# EasyEDA Pro project ProPrj_幻灯机控制板_2025-12-10.epro

# Schematic Schematic1
Board Name: 幻灯机; Create Date: 2025-10-30; Page Name: P1; Project Name: 幻灯机控制板; Schematic Name: Schematic1; Update Date: 2025-11-19; Company: 光水; Drawed: 光水; Page Size: A3; Reviewed: 光水; Version: V1.0
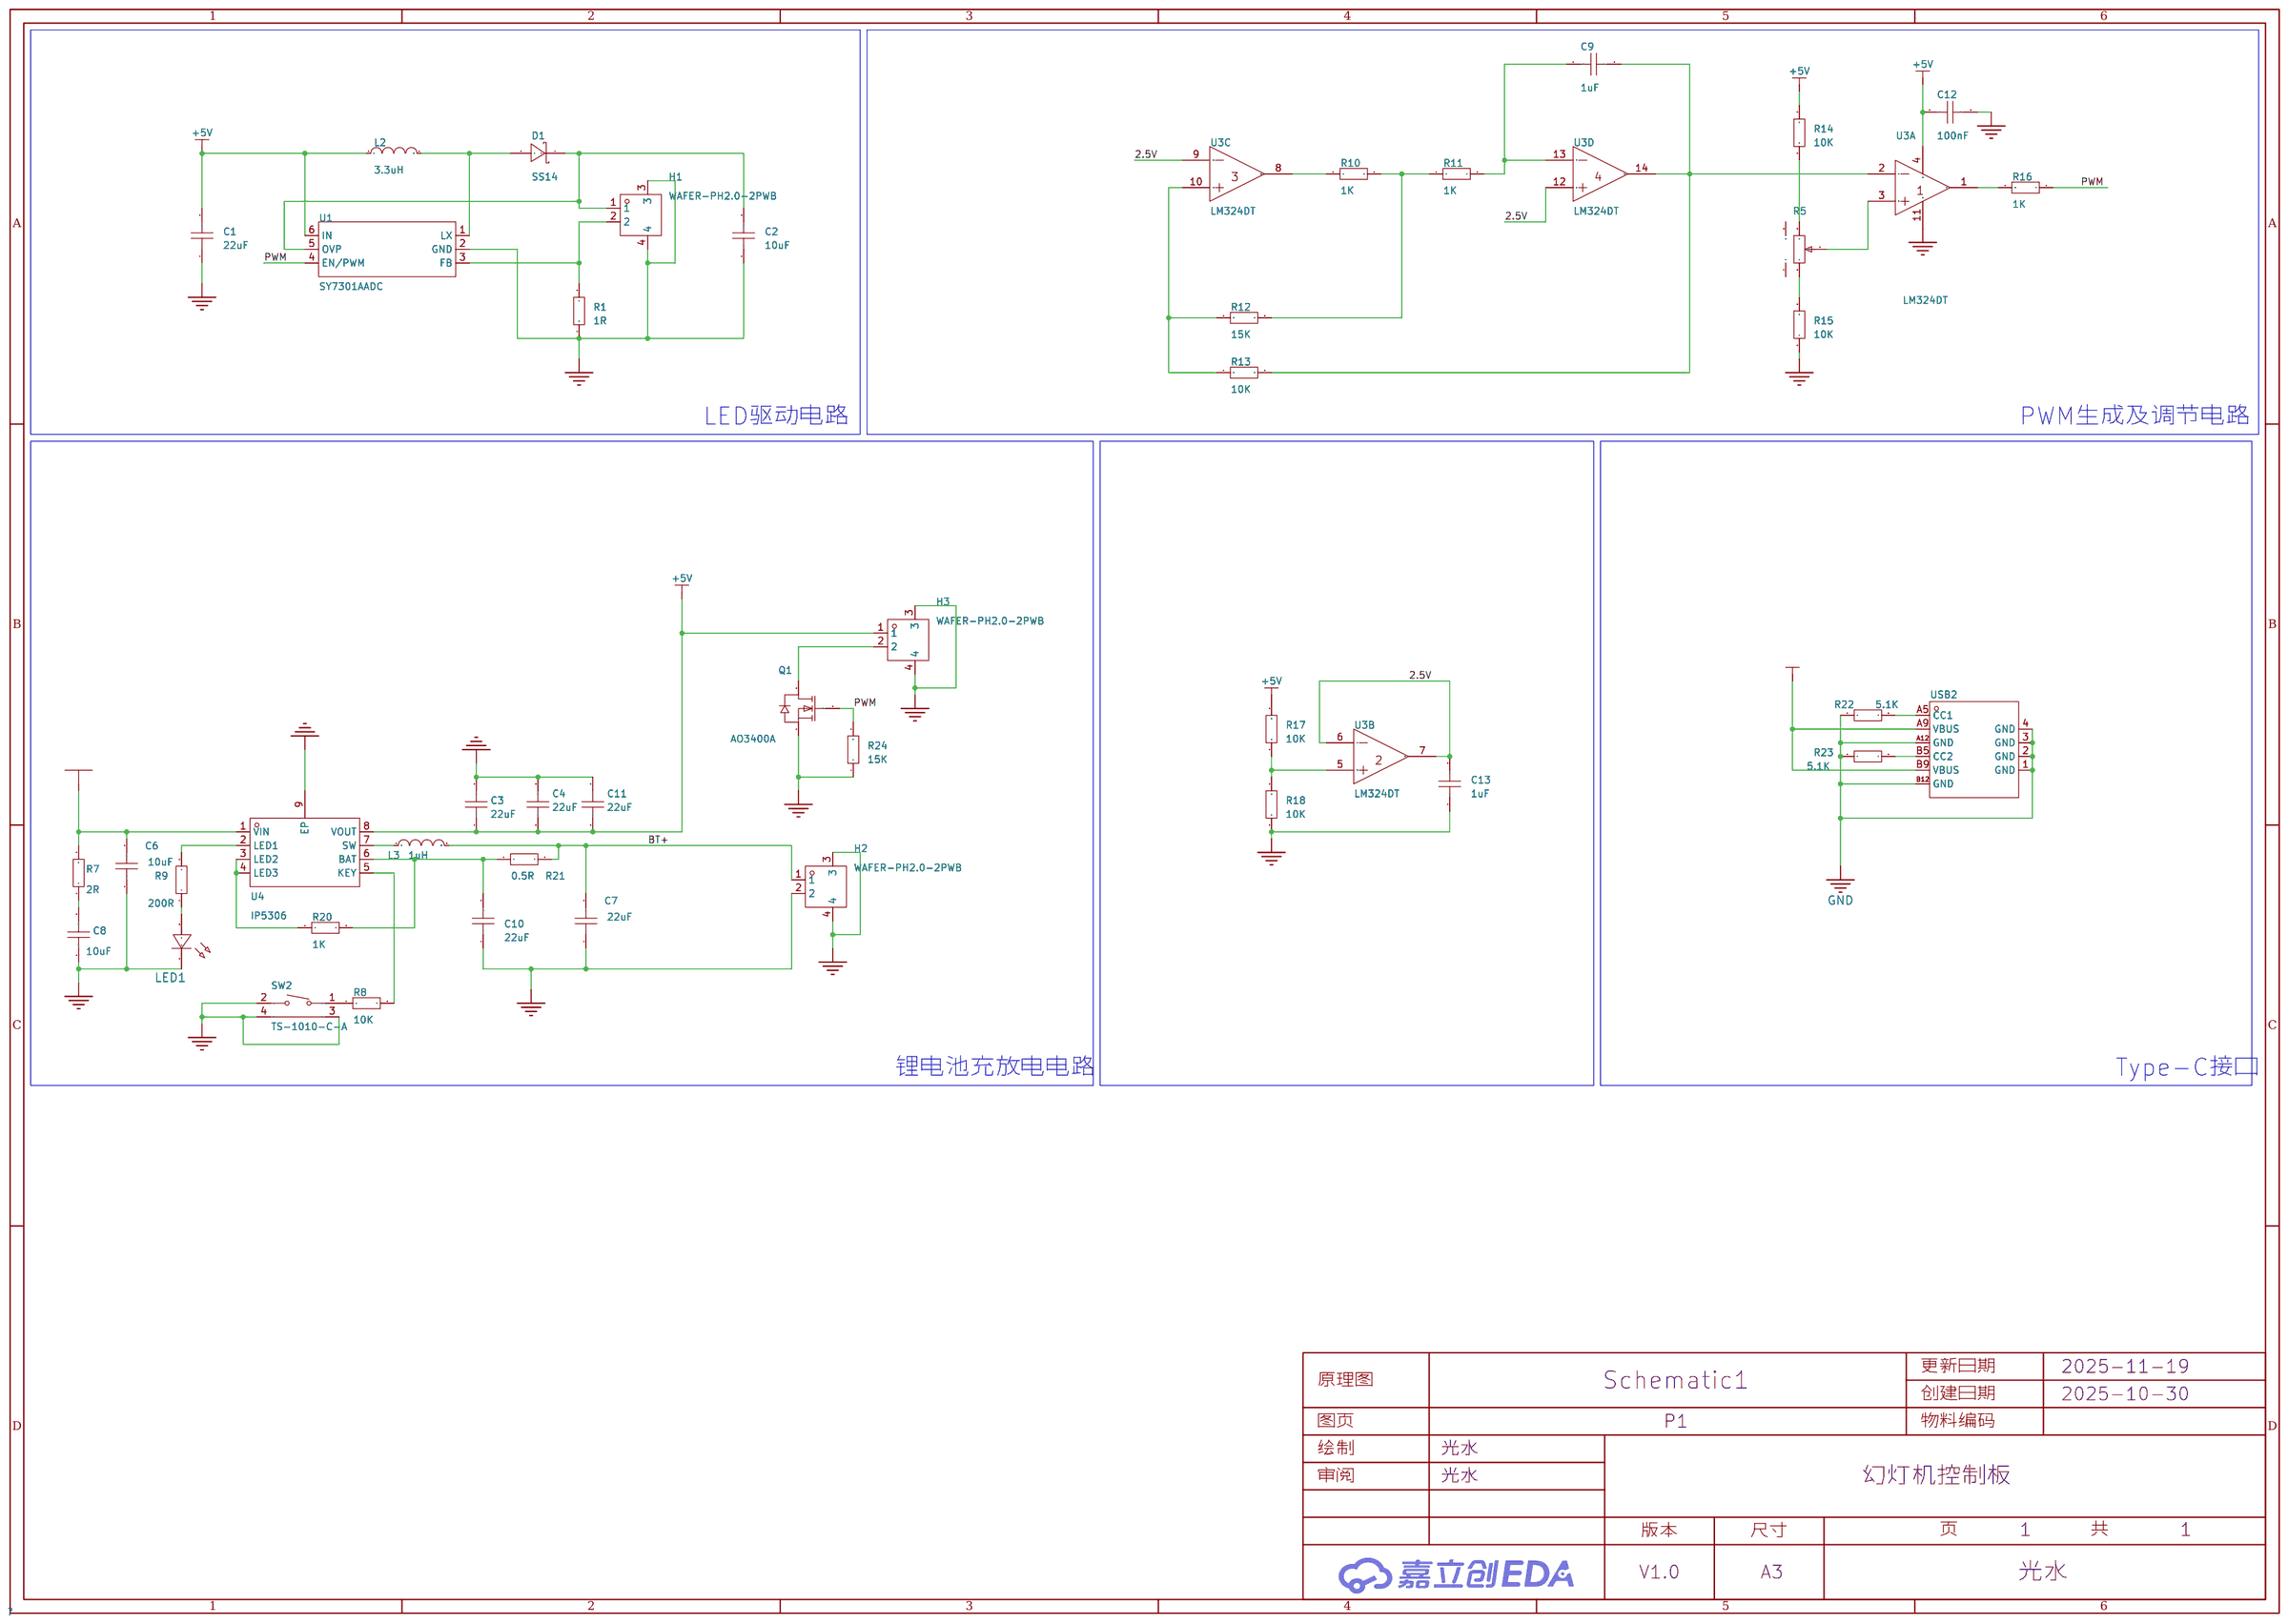
[diagram p0: schematic sheet]

## Parts
C1  22uF  [C0805]
C2  10uF  [C1206]
C3  22uF  [C0805]
C4  22uF  [C0805]
C6  10uF  [C0805]
C7  22uF  [C0805]
C8  10uF  [C0805]
C9  1uF  [C0603]
C10  22uF  [C0805]
C11  22uF  [C0805]
C12  100nF  [C0603]
C13  1uF  [C0603]
D1  SS14  [SMA_L4.2-W2.6-LS5.0-RD_1]
H1  WAFER-PH2.0-2PWB  [CONN-SMD_2P-P2.00_XUNPU_WAFER-PH2.0-2PWB]
H2  WAFER-PH2.0-2PWB  [CONN-SMD_2P-P2.00_XUNPU_WAFER-PH2.0-2PWB]
H3  WAFER-PH2.0-2PWB  [CONN-SMD_2P-P2.00_XUNPU_WAFER-PH2.0-2PWB]
L2  3.3uH  [IND-SMD_L7.3-W6.6]
L3  1uH  [IND-SMD_L6.8-W6.8_SMMS0630]
LED1  -  [LED0603-RD_BLUE]
Q1  AO3400A  [SOT-23-3_L2.9-W1.3-P1.90-LS2.4-BR]
R1  1R  [R1210]
R5  RV09AF-40-15K-B10K  [RES-ADJ-TH_RV09]
R7  2R  [R0603]
R8  10K  [R0603]
R9  200R  [R0603]
R10  1K  [R0603]
R11  1K  [R0603]
R12  15K  [R0603]
R13  10K  [R0603]
R14  10K  [R0603]
R15  10K  [R0603]
R16  1K  [R0603]
R17  10K  [R0603]
R18  10K  [R0603]
R20  1K  [R0603]
R21  0.5R  [R0603]
R22  5.1K  [R0603]
R23  5.1K  [R0603]
R24  15K  [R0603]
SW2  TS-1010-C-A  [KEY-SMD_TX-1010-X-X]
U1  SY7301AADC  [TSOT-23-6_L2.9-W1.6-P0.95-LS2.8-BR]
U3  LM324DT  [SOIC-14_L8.7-W3.9-P1.27-LS6.0-BL]  (sections 1,2,3,4)
U4  IP5306  [ESOP-8_L4.9-W3.9-P1.27-LS6.0-BL-EP]
USB2  -  [usb-c-smd_typec-250d-bcp6]

## Library data of the parts
C1 C10 = CAP_0805: Supplier Footprint: 0805
C2 = CAP_1206: Supplier Footprint: 1206
C3 C4 C6-C8 C11 = CAP_0805: 容值:100nF;精度:±10%;额定电压:50V;温度系数:X7R;; Supplier Footprint: 0805
C9 C12 C13 = CAP_0603: Supplier Footprint: 0603
D1 = SS14_C2480: 二极管配置:独立式;正向压降(Vf):550mV@1A;直流反向耐压(Vr):40V;整流电流:1A;; LCSC Part Name: 电压:40V 电流:1A; Supplier Part: C2480; Manufacturer: MDD(辰达半导体); Supplier Footprint: SMA(DO-214AC); JLCPCB Part Class: 基础库; Datasheet: https://item.szlcsc.com/datasheet/SS14/2857.html; Supplier: LCSC; Diode Configuration: 独立式; Voltage - Forward(Vf@If): 550mV@1A; Voltage - DC Reverse(Vr): 40V; Current - Rectified: 1A; Reverse Leakage Current (Ir): 300uA@40V; Operating Junction Temperature Range: -55℃~+150℃; Non-Repetitive Peak Forward Surge Current: 25A
H1-H3 = WAFER-PH2.0-2PWB: 插针结构:1x2P;间距:2mm;安装方式:卧贴;参考系列:PH;总PIN数:2P;排数:1;每排PIN数:2;行距:-;额定电流:2A;触头材质:黄铜;触头镀层:锡;工作温度:-25℃~+85℃;; LCSC Part Name: 1x2P 间距:2mm 卧贴 系列:PH; Supplier Part: C3029440; Manufacturer: XUNPU(讯普); Supplier Footprint: SMD,P=2mm,卧贴; JLCPCB Part Class: 扩展库; Datasheet: https://item.szlcsc.com/datasheet/WAFER-PH2.0-2PWB/3561452.html; Supplier: LCSC; Pins Structure: 1x2P; Pitch: 2mm; Mounting Type: 卧贴; Reference Series: PH; Number of Pins: 2P; Number of Rows: 1; Number of PINs Per Row: 2; Current Rating: 2A; Contact Material: 黄铜; Contact Plating: 锡; Operating Temperature: -25℃~+85℃; Voltage Rating: 250V; Plastic Material: LCP; Supplementary Features: 辅助焊脚; Color: 米色; Z-Height of the Board: 5.6mm; X-Length of Bottom Edge on Board (Spacing Line): 8mm; Y-Width of Bottom Edge on Board: 7.59mm
L2 = SMMS0630-3R3M: 电感值:3.3uH;精度:±20%;额定电流:-;饱和电流(Isat):9.5A;类型:-;; LCSC Part Name: 3.3uH ±20% 9.5A; Supplier Part: C128687; Manufacturer: SXN(顺翔诺); Supplier Footprint: SMD,7.3x6.6mm; JLCPCB Part Class: 扩展库; Datasheet: https://item.szlcsc.com/datasheet/SMMS0630-3R3M/139972.html; Supplier: LCSC; Tolerance: ±20%; Current - Saturation(Isat): 9.5A; DC Resistance(DCR): 35mΩ
L3 = SMMS0630-1R0M: 电感值:1uH;精度:±20%;额定电流:-;饱和电流(Isat):16A;类型:-;; LCSC Part Name: 1uH ±20% 16A; Supplier Part: C128684; Manufacturer: SXN(顺翔诺); Supplier Footprint: SMD,7.3x6.6mm; JLCPCB Part Class: 扩展库; Datasheet: https://item.szlcsc.com/datasheet/SMMS0630-1R0M/139969.html; Supplier: LCSC; Tolerance: ±20%; Current - Saturation(Isat): 16A; DC Resistance(DCR): 7.25mΩ
LED1 = LED_0603-R: 发光颜色:红灯;二极管配置:-;透镜颜色:无色透明;主波长:617.5nm;峰值波长:632nm;色温:-;光通量(25时):-;测试电流:5mA;正向电压(VF):2.2V;发光强度:28.5mcd;功率:60mW;发光角度:120°;安装方式:-;工作温度:-40~+85;; Supplier Footprint: 0603; Supplier Part: C72044
Q1 = AO3400A_C20917: 数量:-;漏源电压(Vdss):30V;连续漏极电流(Id):-;导通电阻(RDS(on)):48mΩ@2.5V;耗散功率(Pd):-;阈值电压(Vgs(th)):1.45V@250uA;; LCSC Part Name: 1个N沟道 耐压:30V 电流:5.7A; Supplier Part: C20917; Manufacturer: AOS; Supplier Footprint: SOT-23-3L; JLCPCB Part Class: 基础库; Datasheet: https://item.szlcsc.com/datasheet/AO3400A/21629.html; Supplier: LCSC; Drain to Source Voltage: 30V; RDS(on): 48mΩ@2.5V; Gate Threshold Voltage (Vgs(th)): 1.45V@250uA; Gate Charge(Qg): 7nC@10V; Input Capacitance(Ciss): 630pF@15V; Operating Temperature: -55℃~+150℃@(Tj); Type: N沟道
R1 = Res_1210: Supplier Footprint: 1210
R5 = RV09AF-40-15K-B10K: Supplier Part: C5151445; Supplier Footprint: 插件; JLCPCB Part Class: Extended Part; Datasheet: https://atta.szlcsc.comnull; Supplier: LCSC
R7-R18 R20-R24 = Res_0603: Supplier Footprint: 0603
SW2 = TS-1010-C-A: 触点电流:50mA;额定电压(DC):12V;绝缘电阻:100mΩ;电路结构:单刀单掷;安装方式:卧贴;按钮形状:矩形按钮;按钮/盖帽颜色:黑色;带灯:无;作用力:260gf;机械寿命:100000;工作温度:-30℃~+85℃;开关长度:2mm;开关宽度:4mm;开关高度:3.5mm;带支架:否;; LCSC Part Name: 2x4x3.5小侧按260gf带固定柱; Supplier Part: C692458; Manufacturer: XKB Connectivity(中国星坤); Supplier Footprint: SMD; JLCPCB Part Class: 扩展库; Datasheet: https://atta.szlcsc.com/upload/public/pdf/source/20211011/09621D275CE0F472C941775DFBBCCC96.pdf; Supplier: LCSC; Contact Current: 50mA; Voltage Rating (DC): 12V; Insulation Resistance: 100mΩ; Circuit: 单刀单掷; Mounting Style: 卧贴; Actuator Style: 矩形按钮; Actuator/Cap Color: 黑色; With Lamp: 无; Operating Force: 260gf; Mechanical Life: 100000; Operating Temperature: -30℃~+85℃; Switch Length: 2mm; Switch Width: 4mm; Switch Height: 3.5mm; Strike Gundam: 否
U1 = SY7301AADC: 开关频率:800kHz~1.2MHz;通道数:1;调光:PWM；模拟;拓扑结构:升压;; Supplier Part: C160791; Manufacturer: Silergy(矽力杰); Supplier Footprint: TSOT-23-6; JLCPCB Part Class: 扩展库; Datasheet: https://item.szlcsc.com/datasheet/SY7301AADC/172172.html; Supplier: LCSC; Frequency - Switching: 800kHz~1.2MHz; Number of Channels: 1; Dimming: PWM；模拟; Topology: 升压; Operating temperature: -40℃~+125℃
U3 = LM324DT: 放大器数:四路;轨到轨:-;增益带宽积(GBP):1.3MHz;输入失调电压(Vos):5mV;压摆率(SR):20V/us;输入偏置电流(Ib):300nA;; LCSC Part Name: 低功耗四路运算放大器; Supplier Part: C71035; Manufacturer: ST(意法半导体); Supplier Footprint: SOIC-14; Datasheet: https://item.szlcsc.com/datasheet/LM324DT/72134.html; Supplier: LCSC; Number of Channels: 四路; Maximum Power Supply Range (Vdd-Vss): 30V; Gain Bandwidth Product: 1.3MHz; Vos - Input Offset Voltage: 5mV; Input Offset Voltage Drift(Vos TC): 30uV/℃; Slew Rate: 20V/us; Ib - Input Bias Current: 300nA; Input Offset Current(Ios): 20nA; Noise density(eN): 40nV/√Hz@1kHz; Common Mode Rejection Ratio(CMRR): 80dB; Input offset current drift(Ios TC): 200pA/℃; Quiescent Current: 1.2mA; Output Current: 70mA; Operating Temperature: 0℃~+70℃; Single supply: 3V~30V; Dual Supply: -15V~-1.5V；1.5V~15V
U4 = IP5306: 工作电压:4.65V~5.5V;最大充电电流:2.1A;电池类型:锂电池;电池节数:1;; LCSC Part Name: 集成2.1A充电器和2.1A放电器的全集成移动电源系统级芯片; Supplier Part: C181692; Manufacturer: INJOINIC(英集芯); Supplier Footprint: ESOP-8; Datasheet: https://item.szlcsc.com/datasheet/IP5306/193089.html; Supplier: LCSC; The Chip Type: 充电芯片；保护芯片; Voltage - Supply: 4.65V~5.5V; Charge Current - Max: 2.1A; Charging Saturation Voltage: 4.2V; End-Off Voltage: 3V; Type of Battery: 锂电池; Number of Cells: 1; Operating Temperature: 0℃~+70℃; Supply Current (Iq): 100uA; Interface: I2C
USB2 = typec-250d-bcp6: 连接器类型:Type-C;标准:USB 3.1;公母:母座;触点数量:6;端口数量:1;安装方式:卧贴;额定电流 - 电源:3A;工作温度范围:-25~+85;焊接温度(最大值):260;; LCSC Part Name: Type-C 母座 卧贴; Supplier Part: C720626; Manufacturer: XUNPU(讯普); Manufacturer Part: TYPEC-250D-BCP6; Supplier Footprint: SMD,8.94x6.8x3.16mm; JLCPCB Part Class: Extended Part; Datasheet: https://atta.szlcsc.com/upload/public/pdf/source/20200812/C720626_0B3D9525FB9C6D818696E28704B18234.pdf; Supplier: LCSC; Connector Type: Type-C; Standard: USB 3.1; Gender: 母座; Number of Contacts: 6; Number of Ports: 1; Mounting Style: 卧贴; Current Rating - Power (Max): 3A; Operating Temperature Range: -25~+85; Welding Temperature (Max): 260

## Nets
2.5V: C13.2 U3.6(IN2-) U3.7(OUT2) U3.9(IN3-) U3.12(IN4+)
+5V: C1.2 C3.1 C4.1 C11.1 C12.1 H3.1 L2.1 R14.2 R17.2 U1.6(IN) U3.4(VCC+) U4.8(VOUT)
GND: C1.1 C2.1 C3.2 C4.2 C6.1 C7.1 C8.1 C10.1 C11.2 C12.2 C13.1 H1.3 H1.4 H2.2 H2.3 H2.4 H3.3 H3.4 LED1.1(C) Q1.2(S) R1.1 R15.1 R18.1 R22.1 R23.2 R24.1 SW2.2 SW2.3 SW2.4 U1.2(GND) U3.11(VCC-) U4.9(EP) USB2.1(GND) USB2.2(GND) USB2.3(GND) USB2.4(GND) USB2.A12(GND) USB2.B12(GND)
BT+: C7.2 H2.1 L3.2 R21.2
PWM: Q1.1(G) R16.2 R24.2 U1.4(EN/PWM)
VUSB: C6.2 R7.2 U4.1(VIN) USB2.A9(VBUS) USB2.B9(VBUS)
$1N518: D1.2(A) L2.2 U1.1(LX)
$1N603: C2.2 D1.1(K) H1.1 U1.5(OVP)
$1N607: H1.2 R1.2 U1.3(FB)
$1N1217: L3.1 U4.7(SW)
$1N1218: C8.2 R7.1
$1N1224: R9.2 U4.2(LED1)
$1N1228: R8.1 SW2.1
$1N1229: R8.2 U4.5(KEY)
$1N1231: LED1.2(A) R9.1
$1N1695: R10.1 U3.8(OUT3)
$1N1699: R10.2 R11.1 R12.2
$1N1705: C9.1 R11.2 U3.13(IN4-)
$1N1798: R12.1 R13.1 U3.10(IN3+)
$1N1817: C9.2 R13.2 U3.2(IN1-) U3.14(OUT4)
$1N3380: R5.2 U3.3(IN1+)
$1N3457: R16.1 U3.1(OUT1)
$1N3593: R17.1 R18.2 U3.5(IN2+)
$1N3974: R20.1 U4.3(LED2) U4.4(LED3)
$1N4073: C10.2 R20.2 R21.1 U4.6(BAT)
$1N5788: H3.2 Q1.3(D)
$1N5796: R5.3 R14.1
$1N5800: R5.1 R15.2
$1N5934: R22.2 USB2.A5(CC1)
$1N5935: R23.1 USB2.B5(CC2)

Not connected (* = marked no-connect by the designer): R5 4 5

## Notes on the sheet
- LED驱动电路
- PWM生成及调节电路
- 锂电池充放电电路
- Type-C接口

# Board PCB1
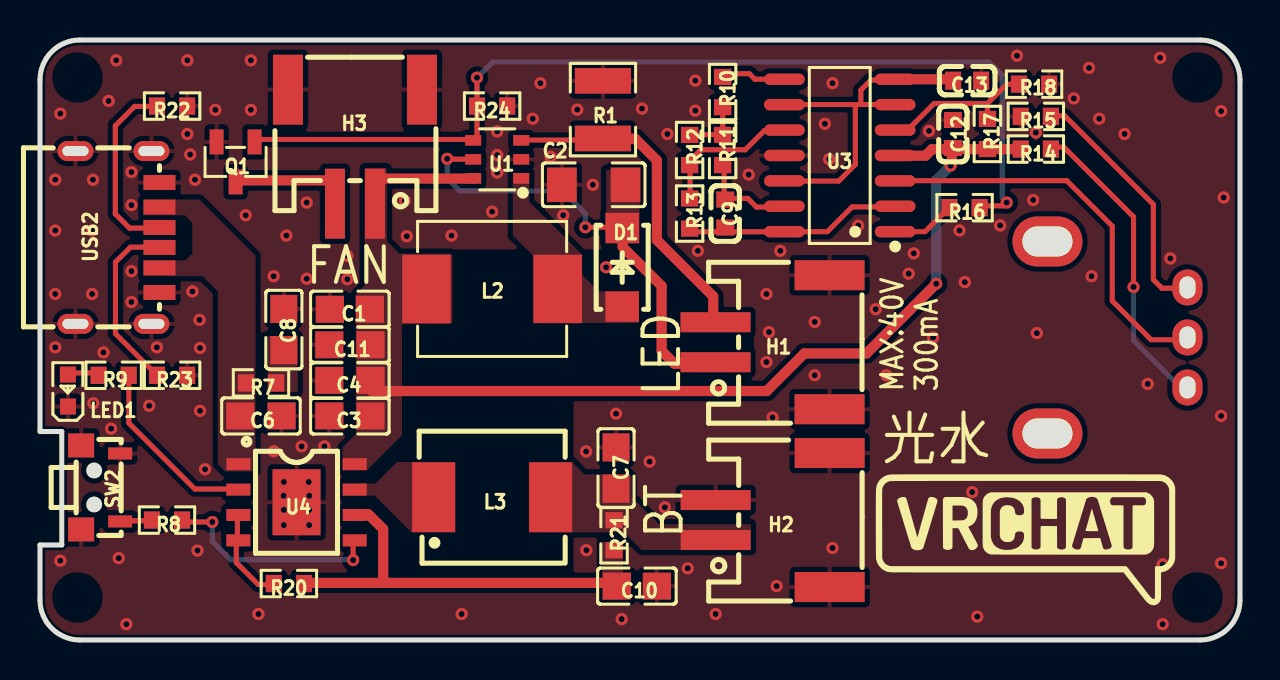
[diagram p1: board, top side]
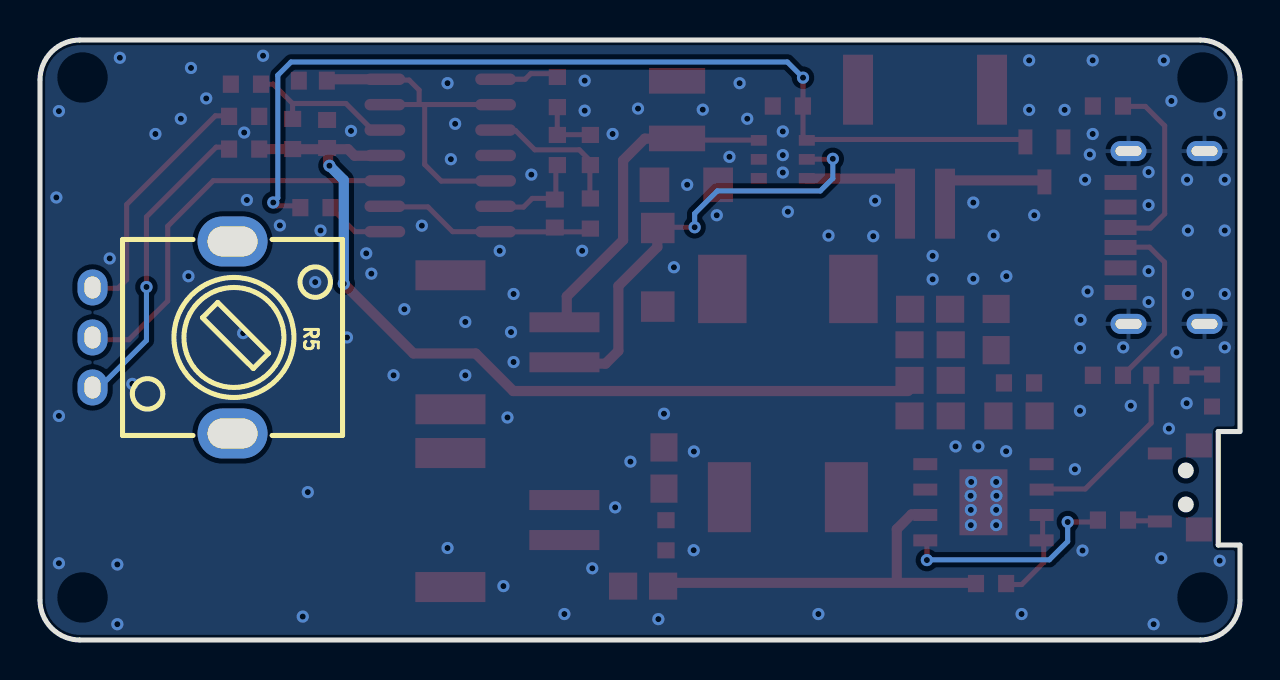
[diagram p2: board, bottom side, seen from below]

Outline 60 x 30 mm; copper layers: Top Layer, Bottom Layer. Coordinates in mm from the lower left corner of the outline.
Outline path: 0,28 arc(0.59,29.41) 2,30 58,30 arc(59.41,29.41) 60,28 60,2 arc(59.41,0.59) 58,0 2,0 arc(0.59,0.59) 0,2 0,4.75 1.09,4.75 1.09,10.42 0,10.42 0,28
Stack: Top Layer 0.035mm / Dielectric1 1.51mm FR4 er 4.5 / Bottom Layer 0.035mm

## Design rules (mm)
template: 自定义配置
spacing copperThickness1oz (default): track to track 0.102, other pairs 0.152 to 0.3
spacing copperThickness2oz: track to track 0.203, other pairs 0.152 to 0.3
track width copperThickness1oz (default): min 0.127, default 0.254, max 2.54
track width copperThickness2oz: min 0.203, default 0.254, max 2.54
differential pair differentialPair (default): width min 0.127, default 0.254, max 2.54; gap min 0.152, default 0.152
via viaSize (default): diameter min 0.5, default 0.61, max 10; hole min 0.3, default 0.305, max 6.3

## Placement (name value [footprint] x y rotation side)
C1  22uF  [C0805]  15.49 16.54 0 top
C2  10uF  [C1206]  27.69 22.76 0 top
C3  22uF  [C0805#2]  15.49 11.2 180 top
C4  22uF  [C0805#2]  15.49 12.98 180 top
C6  10uF  [C0805#2]  11.05 11.2 180 top
C7  22uF  [C0805#2]  28.8 8.6 270 top
C8  10uF  [C0805#2]  12.19 15.52 270 top
C9  1uF  [C0603]  34.26 21.32 270 top
C10  22uF  [C0805]  29.85 2.69 180 top
C11  22uF  [C0805#2]  15.49 14.76 180 top
C12  100nF  [C0603]  45.65 25.3 90 top
C13  1uF  [C0603]  46.36 27.97 180 top
D1  SS14  [SMA_L4.2-W2.6-LS5.0-RD_1]  29.11 18.64 270 top
H1  WAFER-PH2.0-2PWB  [CONN-SMD_2P-P2.00_XUNPU_WAFER-PH2.0-2PWB]  36.63 14.89 90 top
H2  WAFER-PH2.0-2PWB  [CONN-SMD_2P-P2.00_XUNPU_WAFER-PH2.0-2PWB]  36.63 6 90 top
H3  WAFER-PH2.0-2PWB  [CONN-SMD_2P-P2.00_XUNPU_WAFER-PH2.0-2PWB]  15.75 24.67 180 top
L2  3.3uH  [IND-SMD_L7.3-W6.6]  22.61 17.55 180 top
L3  1uH  [IND-SMD_L6.8-W6.8_SMMS0630]  22.61 7.14 0 top
LED1  -  [LED0603-RD_BLUE]  1.4 12.47 90 top
Q1  AO3400A  [SOT-23-3_L2.9-W1.3-P1.90-LS2.4-BR]  9.78 23.9 90 top
R1  1R  [R1210]  28.15 26.52 270 top
R5  RV09AF-40-15K-B10K  [RES-ADJ-TH_RV09]  53.87 15.13 270 bottom
R7  2R  [R0603]  11.05 12.85 180 top
R8  10K  [R0603]  6.35 6 0 top
R9  200R  [R0603]  3.68 13.24 0 top
R10  1K  [R0603]  34.13 27.4 270 top
R11  1K  [R0603]  34.13 24.5 270 top
R12  15K  [R0603]  32.48 24.5 90 top
R13  10K  [R0603]  32.48 21.32 270 top
R14  10K  [R0603]  49.79 24.55 180 top
R15  10K  [R0603]  49.79 26.18 0 top
R16  1K  [R0603]  46.23 21.62 0 top
R17  10K  [R0603]  47.37 25.3 270 top
R18  10K  [R0603]  49.7 27.79 180 top
R20  1K  [R0603]  12.45 2.82 0 top
R21  0.5R  [R0603]  28.7 5.23 90 top
R22  5.1K  [R0603]  6.6 26.7 180 top
R23  5.1K  [R0603]  6.6 13.24 0 top
R24  15K  [R0603]  22.61 26.7 180 top
SW2  TS-1010-C-A  [KEY-SMD_TX-1010-X-X]  3.03 7.63 90 top
U1  SY7301AADC  [TSOT-23-6_L2.9-W1.6-P0.95-LS2.8-BR]  22.86 24.03 0 top
U3  LM324DT  [SOIC-14_L8.7-W3.9-P1.27-LS6.0-BL]  39.99 24.23 90 top
U4  IP5306  [ESOP-8_L4.9-W3.9-P1.27-LS6.0-BL-EP]  12.83 6.89 270 top
USB2  -  [usb-c-smd_typec-250d-bcp6]  3.87 20.13 270 top

## Footprints (pads in the part's own frame, mm; a bottom-side part is the same pattern mirrored in y, then rotated)
C0603
  rect 0.8x0.9 smd: 1(-0.7,0) 2(0.7,0)
C0805
  rect 1.41x1.35 smd: 1(-1,0) 2(1,0)
C0805#2
  rect 1.41x1.35 smd: 1(-1.03,0) 2(1.03,0)
C1206
  rect 1.485x1.728 smd: 1(-1.593,0) 2(1.593,0)
CONN-SMD_2P-P2.00_XUNPU_WAFER-PH2.0-2PWB
  rect 1x3.5 smd: 1(-1,2.85) 2(1,2.85)
  rect 1.5x3.5 smd: 3(-3.35,-2.85) 4(3.35,-2.85)
ESOP-8_L4.9-W3.9-P1.27-LS6.0-BL-EP
  rect 0.6x1.2 smd: 1(-1.905,-2.909) 2(-0.635,-2.909) 3(0.635,-2.909) 4(1.905,-2.909) 5(1.905,2.909) 6(0.635,2.909) 7(-0.635,2.909) 8(-1.905,2.909)
  rect 3.3x2.4 smd: 9(0,0)
IND-SMD_L6.8-W6.8_SMMS0630
  rect 2.15x3.5 smd: 1(-2.925,0) 2(2.925,0)
IND-SMD_L7.3-W6.6
  rect 2.424x3.42 smd: 1(3.278,0) 2(-3.278,0)
KEY-SMD_TX-1010-X-X
  rect 0.6x1.2 smd: 1(-1.7,-0.975) 2(1.7,-0.975)
  rect 1.2x1.3 smd: 3(-2.1,0.975) 4(2.1,0.975)
LED0603-RD_BLUE
  rect 0.8x0.8 smd: 1(-0.8,-0.003) 2(0.8,0.003)
R0603
  rect 0.806x0.864 smd: 1(-0.753,0) 2(0.753,0)
R1210
  rect 1.282x2.808 smd: 1(-1.441,0) 2(1.441,0)
RES-ADJ-TH_RV09
  oval 1.8x1.5 hole 1.1x0.8: 1(-2.5,-3.5) 2(0,-3.5) 3(2.5,-3.5)
  oval 2.5x3.5 hole 1.5x2.5: 4(4.8,3.5) 5(-4.8,3.5)
SMA_L4.2-W2.6-LS5.0-RD_1
  rect 1.52x1.68 smd: 1(-1.965,0) 2(1.965,0)
SOIC-14_L8.7-W3.9-P1.27-LS6.0-BL
  oval 0.574x2.038 smd: 1(-3.81,-2.769) 2(-2.54,-2.769) 3(-1.27,-2.769) 4(0,-2.769) 5(1.27,-2.769) 6(2.54,-2.769) 7(3.81,-2.769) 8(3.81,2.769) 9(2.54,2.769) 10(1.27,2.769) 11(0,2.769) 12(-1.27,2.769) 13(-2.54,2.769) 14(-3.81,2.769)
SOT-23-3_L2.9-W1.3-P1.90-LS2.4-BR
  rect 1.25x0.7 smd: 1(1,-0.95) 2(1,0.95) 3(-1,0)
TSOT-23-6_L2.9-W1.6-P0.95-LS2.8-BR
  rect 0.8x0.532 smd: 1(1.2,-0.95) 2(1.2,0) 3(1.2,0.95) 4(-1.2,0.95) 5(-1.2,0) 6(-1.2,-0.95)
usb-c-smd_typec-250d-bcp6
  oval 1x1.8 hole 0.5x1.3: 1(-4.32,1.7) 2(-4.32,-2.1) 3(4.32,-2.1) 4(4.32,1.7)
  rect 0.75x1.6 smd: A5(-0.5,2.1) A9(1.52,2.1) A12(2.75,2.1) B5(0.5,2.1) B9(-1.52,2.1) B12(-2.75,2.1)

## Nets
As in the schematic.

Pads without a net: R5 4 5

## Via types
v1: diameter 0.61, hole 0.305, Top Layer to Bottom Layer, 134 vias

## Routing (per net, layer and track width the routed paths; a pad name or vN(x,y) marks a point on that pad's centre or on a via; arc(x,y) is an arc through that point)
2.5V: length 17.9
  Top Layer w0.254: 40.77,26.77 37.36,26.77 37.26,26.87 ; 40.77,26.77 42.91,26.77 ; 40.77,26.77 40.77,23.78 39.94,22.95 37.19,22.95 ; 41.04,26.79 41.04,27.5 41.54,28 42.48,28
  Top Layer w0.508: 45.66,27.97 45.59,28.04 U3.7
+5V: length 50.2
  Top Layer w0.508: 16.59,12.45 36.34,12.45 38.22,14.33 41.33,14.33 v1(44.81,17.81) ; 42.83,24.21 44.27,24.21 44.6,24.54 45.59,24.54 ; 49.06,24.59 49.02,24.54 45.59,24.54 ; v1(45.53,23.71) 45.59,23.78 45.59,24.54 ; 16.64,21.79 16.64,23.04 16.66,23.07 21.65,23.07
  Bottom Layer w0.508: v1(45.53,23.71) 44.81,23 v1(44.81,17.81)
GND:
  vias: v1(0.76,23.02) v1(0.76,20.47) v1(0.76,17.3) v1(0.76,14.63) v1(1.02,26.32) v1(1.02,3.96) v1(2.6,20.47) v1(2.6,17.3) v1(2.65,23.02) v1(2.67,11.84) v1(3.18,14.38) v1(3.43,26.95) v1(3.56,10.57) v1(3.81,28.98) v1(3.94,4.09) v1(4.32,0.79) v1(4.57,23.4) v1(4.57,21.74) v1(4.57,18.44) v1(4.57,16.9) v1(5.46,11.71) v1(5.84,14.63) v1(7.37,28.98) v1(7.37,25.3) v1(7.51,24.27) v1(7.62,17.43) v1(7.75,23.02) v1(7.87,4.47) v1(7.98,16.01) v1(8,14.6) v1(8,11.46) v1(8.26,8.54) v1(8.77,26.51) v1(10.29,21.24) v1(10.54,28.98) v1(10.54,26.51) v1(10.92,1.3) v1(11.68,18.19) v1(11.69,9.44) v1(12.19,7.9) v1(12.18,7.21) v1(12.19,6.5) v1(12.19,5.74) v1(12.32,20.22) v1(13.08,9.68) v1(13.33,21.87) v1(13.33,18.06) v1(13.44,7.9) v1(13.47,7.21) v1(13.46,6.5) v1(13.46,5.74) v1(14.22,9.68) v1(15.37,19.2) v1(15.37,18.04) v1(18.25,21.97) v1(18.34,20.19) v1(20.57,20.22) v1(21.08,1.3) v1(22.61,21.41) v1(22.86,25.43) v1(22.86,24.24) v1(22.86,23.37) v1(24.64,26.06) v1(25.02,27.84) v1(25.53,24.16) v1(26.16,21.24) v1(26.86,26.52) v1(27.3,9.43) v1(27.32,4.49) v1(27.64,22.76) v1(28.3,18.64) v1(28.8,11.31) v1(29.08,1.04) v1(30.1,26.57) v1(30.48,8.92) v1(31.24,6.63) v1(31.37,25.3) v1(32.39,3.58) v1(32.77,27.97) v1(32.77,26.47) v1(32.89,19.46) v1(33.78,1.3) v1(35.43,23.27) v1(36.32,17.3) v1(36.32,13.9) v1(36.45,15.39) v1(36.63,11.13) v1(36.83,2.69) v1(37.02,19.46) v1(38.73,15.9) v1(38.73,13.24) v1(39.24,25.81) v1(39.46,24.04) v1(39.62,27.84) v1(39.62,4.6) v1(40.91,20.72) v1(41.78,16.54) v1(42.32,13.24) v1(43.43,18.32) v1(43.69,19.33) v1(44.45,25.45) v1(44.65,15.13) v1(45.97,20.47) v1(46.24,17.89) v1(46.61,7.39) v1(46.86,1.17) v1(48.01,20.73) v1(48.85,29.21) v1(49.66,22) v1(49.79,25.37) v1(49.84,15.35) v1(51.69,27.08) v1(52.45,28.6) v1(52.58,18.19) v1(52.96,26.06) v1(54.23,25.3) v1(55.38,12.8) v1(56.01,29.11) v1(56.13,3.78) v1(56.13,0.79) v1(56.52,19.08) v1(59.05,26.44) v1(59.05,11.2) v1(59.05,3.84) v1(59.18,22.13)
PWM: length 48.7
  Top Layer w0.254: 21.85,26.68 21.85,25.19 21.62,24.96 ; 47.04,21.71 48.17,21.71 v1(48.34,21.87) ; 10.78,24.82 10.99,25.03 21.58,25.03 ; v1(21.85,28.12) 21.85,26.76
  Bottom Layer w0.254: v1(21.85,28.12) 22.63,28.9 47.45,28.9 48.11,28.24 48.11,22.1 v1(48.34,21.87)
$1N603: length 22.5
  Top Layer w0.254: v1(27.27,20.64) 28.9,20.64 28.98,20.72 ; 21.61,24.04 20.38,24.04 v1(20.36,24.06)
  Top Layer w0.508: 29.13,20.89 29.13,19.65 31.08,17.7 31.08,14.46 31.72,13.82 33.79,13.82
  Bottom Layer w0.254: v1(20.36,24.06) 20.36,23.08 20.99,22.45 26.13,22.45 27.27,21.32 v1(27.27,20.64)
$1N607: length 16.8
  Top Layer w0.254: 28.13,25.11 28.08,25.07 28.01,25 24.01,25
  Top Layer w0.508: 28.13,25.07 29.76,25.07 30.84,23.98 30.84,19.99 33.66,17.18 33.66,15.82 ; 28.08,25.07 27.94,25.07
$1N1224: length 9.4
  Top Layer w0.254: 4.4,13.35 4.44,13.31 4.44,10.85 7.74,7.55 9.91,7.55
$1N1228: length 1.7
  Top Layer w0.254: 4.1,5.9 4.16,5.96 5.53,5.96 5.67,6.11
$1N1229: length 11.3
  Top Layer w0.254: 15.71,5.01 15.66,4.96 v1(15.66,4) ; v1(8.62,5.9) 7.19,5.9 6.9,6.19
  Bottom Layer w0.254: v1(8.62,5.9) 8.62,4.93 9.53,4.01 15.64,4.01 v1(15.66,4)
$1N1231: length 1.5
  Top Layer w0.254: 2.85,13.31 2.81,13.35 1.41,13.35
$1N1695: length 3.3
  Top Layer w0.254: 34.02,28.32 35.46,28.32 35.74,28.04 37.12,28.04 37.15,28.01
$1N1699: length 3.2
  Top Layer w0.254: 32.49,25.27 34.13,25.27 34.14,25.26 34.14,26.64 34.01,26.77
$1N1705: length 4.6
  Top Layer w0.254: 34.32,22.08 35.39,22.08 35.82,21.65 36.99,21.65 37,21.66 ; 34.21,22.01 34.21,23.65 34.11,23.75
$1N1798: length 6.8
  Top Layer w0.254: 37.08,25.47 36.22,25.47 35.26,24.51 33.03,24.51 32.42,23.9 ; 32.51,22.19 32.51,23.69
$1N1817: length 10.8
  Top Layer w0.254: 37.29,20.46 37.33,20.42 39.37,20.42 40.61,21.66 42.75,21.66 ; 32.44,20.56 32.59,20.41 37.21,20.41
$1N3380: length 20.2
  Top Layer w0.254: 42.67,22.97 51.34,22.97 53.61,20.69 53.61,16.95 55.55,15.01 57.4,15.01
$1N3457: length 3
  Top Layer w0.254: 45.45,21.61 44.25,20.42 42.9,20.42
$1N3593: length 7.9
  Top Layer w0.254: 48.95,27.79 48.34,27.79 47.37,26.82 ; 47.37,26.82 47.37,26.82 R17.1 ; 47.37,26.82 44.7,26.82 43.38,25.5 U3.5
$1N3974: length 4.9
  Top Layer w0.254: 9.9,5.08 9.87,5.11 9.87,6.28 ; 11.86,2.79 11.85,2.77 10.91,2.77 9.81,3.87 9.81,5.08
$1N4073: length 20
  Top Layer w0.508: 15.71,6.28 16.42,6.28 17.16,5.54 17.16,2.94 17.13,2.91 ; 13.18,2.86 28.68,2.86 28.72,2.81
$1N5788: length 5
  Top Layer w0.508: 14.76,22.95 14.73,22.98 9.75,22.98
$1N5796: length 15.2
  Top Layer w0.254: v1(54.68,17.65) 54.68,21.16 51.19,24.64 50.59,24.64
  Bottom Layer w0.254: 57.12,12.54 54.68,14.98 v1(54.68,17.65)
$1N5800: length 12.5
  Top Layer w0.254: 57.31,17.59 56.1,17.59 55.67,18.02 55.67,21.77 51.23,26.21 50.57,26.21
$1N5934: length 9.4
  Top Layer w0.254: 5.86,26.62 5.8,26.68 4.73,26.68 3.77,25.71 3.77,21.3 4.48,20.59 5.94,20.59
$1N5935: length 8.9
  Top Layer w0.254: 5.76,13.32 3.77,15.31 3.77,18.89 4.52,19.64 6.01,19.64

## Copper pours and planes (outline as drawn; the poured copper is in the pictures)
+5V on Top Layer: 15.12,23.6 20.63,23.6 20.63,8.49 15.12,8.49
GND on Top Layer: -1.91,31.91 61.72,31.91 61.72,-2.13 -1.91,-2.13
GND on Bottom Layer: -3.81,33.81 63.25,33.81 63.25,-3.66 -3.81,-3.66
BT+ on Top Layer: 24.45,8.9 35.55,8.9 35.55,4.5 24.45,4.5
VUSB on Top Layer: 5.17,22.02 10.78,22.02 10.78,8.43 5.17,8.43
$1N518 on Top Layer: 24.67,19.28 29.92,19.28 29.92,15.85 24.67,15.85
$1N518 on Top Layer: 23.64,23.35 27.11,23.35 27.11,15.85 23.64,15.85
$1N603 on Top Layer: 28.31,23.5 29.98,23.5 29.98,19.83 28.31,19.83
$1N1217 on Top Layer: 15.13,8.9 20.77,8.9 20.77,5.39 15.13,5.39
$1N1218 on Top Layer: 11.38,15.21 12.88,15.21 12.88,12.4 11.38,12.4
$1N4073 on Top Layer: 28.1,4.9 29.15,4.9 29.15,2.01 28.1,2.01

## Text on the board
Top Silkscreen Layer: MAX:40V / 300mA | FAN | LED | BT | 光水
